# EAGLE design SolarSprinkler (EAGLE 7.5.0)
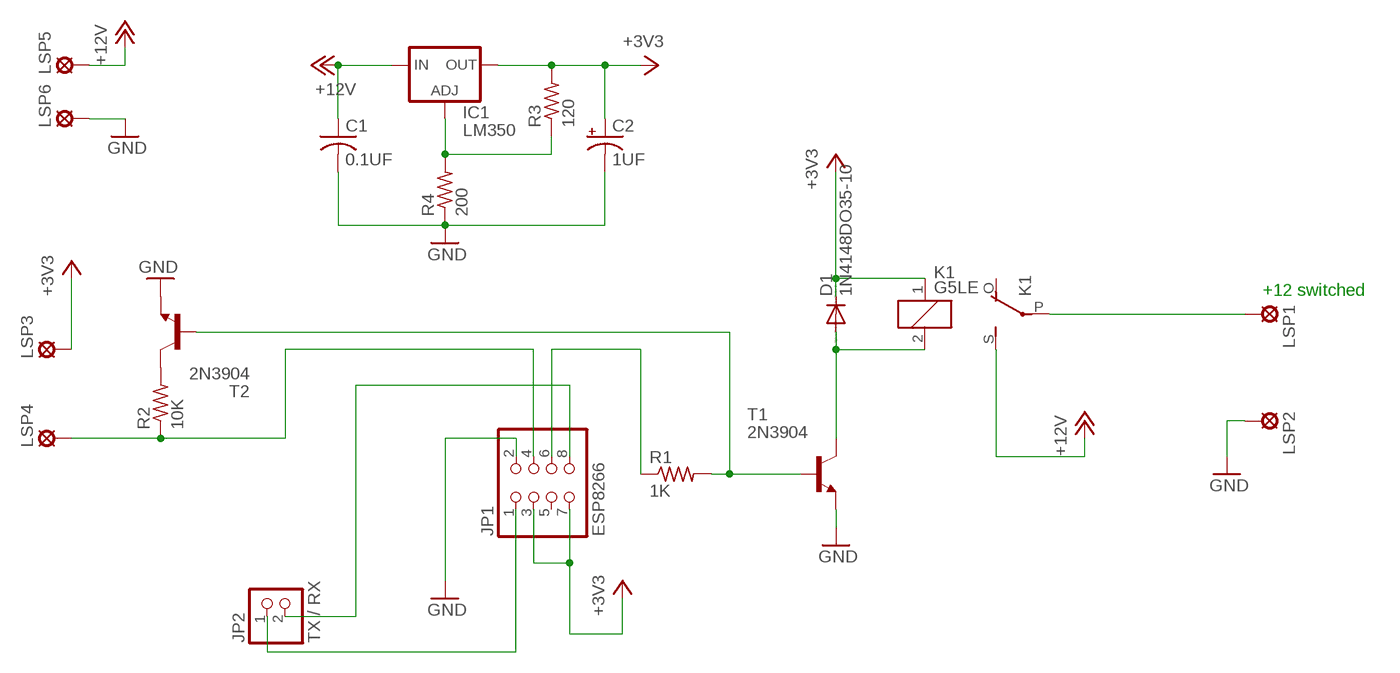
[diagram p0: schematic, sheet 1]

## Parts
C1  0.1UF  C-US025-030X050  [C025-030X050]
C2  1UF  CPOL-USE2.5-5  [E2,5-5]
D1  1N4148DO35-10  [DO35-10]
IC1  LM350  LM317TL  [317TL]
JP1  ESP8266  PINHD-2X4  [2X04]
JP2  TX / RX  PINHD-1X2  [1X02]
K1  G5LE  [G5LE]
LSP1  SE14  [SE14]
LSP2  SE14  [SE14]
LSP3  SE14  [SE14]
LSP4  SE14  [SE14]
LSP5  SE14  [SE14]
LSP6  SE14  [SE14]
R1  1K  R-US_0309/12  [0309/12]
R2  10K  R-US_0309/12  [0309/12]
R3  120  R-US_0309/12  [0309/12]
R4  200  R-US_0309/12  [0309/12]
T1  2N3904  [TO92]
T2  2N3904  [TO92]

## Nets
+3V3 [3v]: C2.+ D1.C IC1.2(OUT) JP1.3 JP1.7 K1.1 LSP3.MP R3.2
+12V [12v]: C1.1 IC1.3(IN) K1.S(2:S) LSP5.MP
GND [Ground]: C1.2 C2.- JP1.2 LSP2.MP LSP6.MP R4.1 T1.3(E) T2.3(E)
N$1: JP1.6 R1.1
N$2: R1.2 T1.2(B) T2.2(B)
N$3: D1.A K1.2 T1.1(C)
N$4: R2.2 T2.1(C)
N$5 [12v switched]: K1.P(2:P) LSP1.MP
N$6: JP1.4 LSP4.MP R2.1
N$8: IC1.1(ADJ) R3.1 R4.2
N$10: JP1.8 JP2.2
N$11: JP1.1 JP2.1
Unconnected: JP1.5 K1.O(2:O)

## Notes on the sheet
- +12 switched

## Library data of the parts
C1 = rcl:C-US: CAPACITOR, American symbol
C2 = rcl:CPOL-US: POLARIZED CAPACITOR, American symbol
D1 = diode:1N4148: DIODE high speed (Philips)
IC1 = v-reg:LM317TL: VOLTAGE REGULATOR
JP1 = pinhead:PINHD-2X4: PIN HEADER
JP2 = pinhead:PINHD-1X2: PIN HEADER
K1 = relay:G5LE: RELAY 1 x switch, 10 A/120 V AC, 8 A/30 V DC, Omron; OC_FARNELL: unknown; OC_NEWARK: unknown
LSP1-LSP6 = solpad:SE14: SOLDER PAD E1553, drill 1,4mm, distributor Buerklin, 07F820
R1-R4 = resistor:R-US_: RESISTOR, American symbol
T1 T2 = transistor:2N3904: NPN TRANSISTOR

## Net classes
0 default: width 0.61 mm
1 Ground: width 0.914 mm
2 12v: width 0.914 mm
3 3v: width 0.61 mm
4 12v switched: width 0.914 mm

## Board
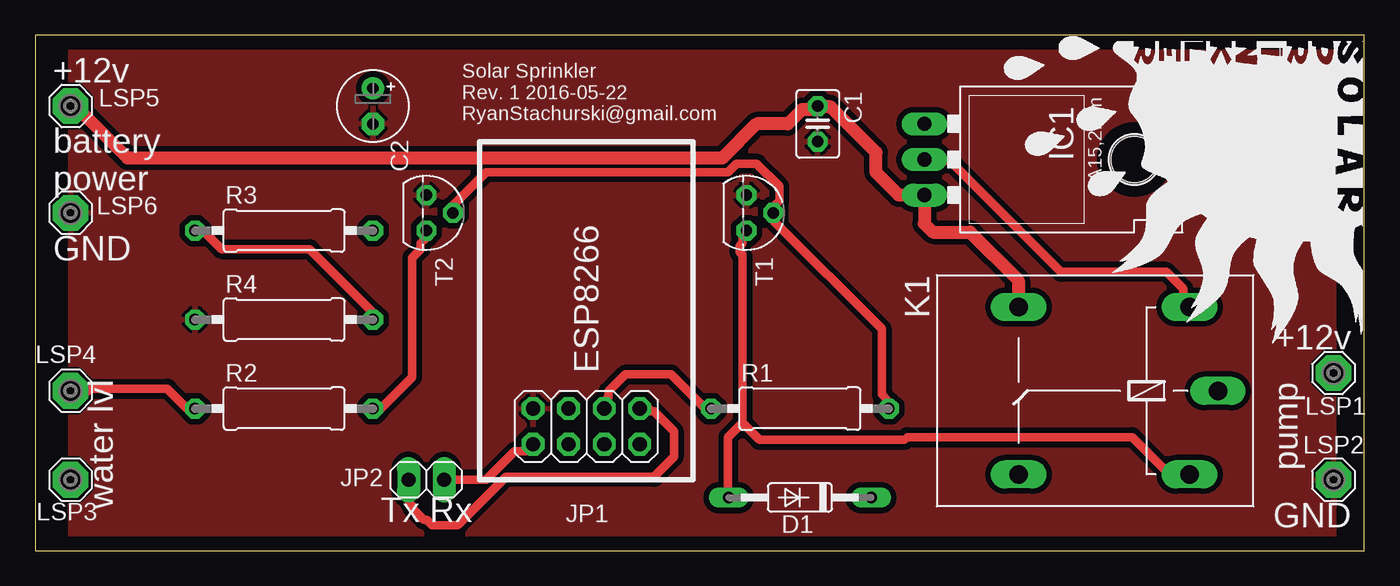
[diagram p1: board, top side]
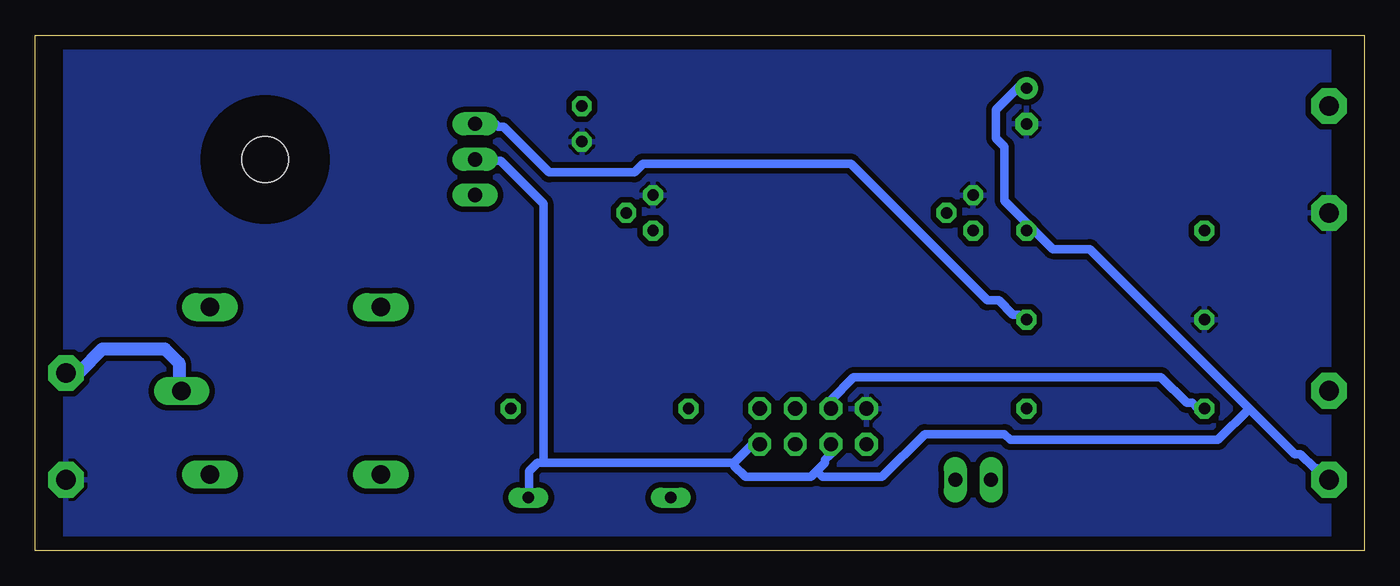
[diagram p2: board, bottom side, seen from below]

Size 94.92 x 36.82 mm. Coordinates in mm from the lower left corner, seen from the top.
Outline: 0,0 94.92,0 94.92,36.82 0,36.82 0,0
Copper layers (1*16): Top 0.035mm / dielectric 1.5mm / Bottom 0.035mm
Design rules "default *": minimum track width 10mil, minimum drill 24mil, track to track 8mil, track to pad 8mil, pad to pad 8mil, via to via 8mil, smd to smd 8mil, copper to edge 40mil, drill to drill 8mil, minimum pad ring 12mil, minimum via ring 8mil, stop-mask expansion 4mil, vias tented up to drill 0mil, thermal gap 10mil

### Footprints (pad centres in the part's own frame; a part is rotated, then mirrored left to right if it is on the bottom)
C025-030X050 = drill 0.813 octagon: 1 -1.27,0; 2 1.27,0
E2,5-5 = drill 0.813 pad 1.6: + -1.27,0 | drill 0.813 pad 1.6 octagon: - 1.27,0
DO35-10 = drill 0.813 long: A 5.08,0; C -5.08,0
317TL = drill 1.016 long: 1 -2.54,-3.81; 2 0,-3.81; 3 2.54,-3.81 | hole 3.302: 0,11.176
2X04 = drill 1.016 octagon: 1 -3.81,-1.27; 2 -3.81,1.27; 3 -1.27,-1.27; 4 -1.27,1.27; 5 1.27,-1.27; 6 1.27,1.27; 7 3.81,-1.27; 8 3.81,1.27
1X02 = drill 1.016 long: 1 -1.27,0; 2 1.27,0
G5LE = drill 1.321 long: 1 -7.493,-5.969; 2 -7.493,5.969; O 4.699,5.969; P -9.525,0; S 4.699,-5.969
SE14 = drill 1.397 pad 2.54 octagon: MP 0,0
0309/12 = drill 0.813 octagon: 1 -6.35,0; 2 6.35,0
TO92 = drill 0.813 octagon: 1 1.27,0; 2 0,1.905; 3 -1.27,0

### Placement (x,y rotation side)
C1  55.88,30.48 270 top
C2  24.13,31.75 270 top
D1  54.61,3.81 180 top
IC1  67.31,27.94 270 top
JP1  39.37,8.89 0 top
JP2  27.94,5.08 180 top
K1  74.93,11.43 180 top
LSP1  92.71,12.7 0 top
LSP2  92.71,5.08 0 top
LSP3  2.54,5.08 0 top
LSP4  2.54,11.43 0 top
LSP5  2.54,31.75 0 top
LSP6  2.54,24.13 0 top
R1  54.61,10.16 0 top
R2  17.78,10.16 0 top
R3  17.78,22.86 0 top
R4  17.78,16.51 0 top
T1  50.8,24.13 270 top
T2  27.94,24.13 270 top

### Tracks (layer width: path | path; a pad name or v marks a point on that pad's centre or on a via)
+3V3
  Top 0.61: IC1.2 63.5,27.84 65.33,27.84 73.25,19.91 80.77,19.91 81.99,18.69 81.99,17.88 82.4,17.48 K1.1
  Bottom 0.61: C2.+ 24.28,33.12 24.69,33.12 26.31,31.5 26.31,29.46 25.71,28.85 25.71,24.99 24.08,23.37 24.08,22.96 R3.2 23.88,23.16 22.25,21.54 19.61,21.54 8.23,10.16 | LSP3.MP 3.35,5.89 3.56,5.89 4.57,6.91 4.98,6.91 8.23,10.16 | 45.01,6.3 58.62,6.3 | 58.62,6.3 59.03,6.3 59.64,5.69 59.64,3.86 D1.C | 45.01,6.3 43.79,7.52 43.18,7.52 JP1.7 | JP1.3 38.1,6.91 38.51,6.5 38.51,6.3 39.12,5.69 | 39.12,5.69 39.52,5.28 44.2,5.28 45.01,6.1 45.01,6.3 | 58.62,6.3 58.62,24.79 61.67,27.84 63.5,27.84 IC1.2 | 8.23,10.16 10.46,7.92 25.3,7.92 25.71,8.33 31.39,8.33 34.44,5.28 38.71,5.28 39.12,5.69
+12V
  Top 0.914: K1.S 70.21,17.48 70.21,19.3 66.75,22.76 64.11,22.76 63.5,23.37 IC1.3 61.67,25.4 60.05,27.03 60.05,28.45 56.79,31.7 55.98,31.7 C1.1 55.58,31.5 54.76,31.5 53.75,30.48 51.51,30.48 49.07,28.04 6.6,28.04 2.95,31.7 2.54,31.7 LSP5.MP
GND
  pour Top (isolate 0.406): 2.54,0 2.54,36.83 92.71,36.83 92.71,0
  pour Bottom (isolate 0.406): 2.54,0 2.54,36.83 92.71,36.83 92.71,0
N$1
  Top 0.61: R1.1 47.85,10.16 45.41,12.6 42.16,12.6 40.95,11.38 40.95,10.97 40.74,10.77 40.74,10.16 JP1.6
N$2
  Top 0.61: R1.2 60.86,10.16 60.86,10.77 60.45,11.18 60.45,15.85 52.73,23.57 52.73,23.98 T1.2 52.93,24.18 52.93,24.38 52.73,24.59 53.14,24.99 53.14,26.01 51.51,27.64 50.09,27.64 49.48,27.03 32.21,27.03 29.77,24.59 29.77,24.18 T2.2
N$3
  Top 0.61: 50.49,9.14 49.48,8.13 49.48,3.86 D1.A | 50.49,9.14 50.49,21.13 50.29,21.34 50.29,21.74 50.49,21.95 50.49,22.35 50.9,22.76 T1.1 | 50.49,9.14 51.71,7.92 62.08,7.92 62.28,8.13 78.33,8.13 80.97,5.49 82.4,5.49 K1.2
N$4
  Top 0.61: R2.2 24.69,10.16 26.92,12.39 26.92,20.93 27.53,21.54 27.53,21.95 27.94,22.35 T2.1
N$5
  Bottom 0.914: K1.P 84.63,11.58 84.63,13.41 85.65,14.43 90.12,14.43 91.74,12.8 92.56,12.8 LSP1.MP
N$6
  Top 0.61: R2.1 10.87,10.16 9.45,11.58 3.96,11.58 3.56,11.18 2.74,11.18 2.54,11.38 LSP4.MP
  Bottom 0.61: JP1.4 38.1,10.77 36.47,12.39 14.53,12.39 12.7,10.57 12.29,10.57 11.89,10.16 R2.1
N$8
  Top 0.61: R4.2 24.08,16.66 24.08,17.07 19.61,21.54 13.31,21.54 11.89,22.96 11.48,22.96 R3.1
  Bottom 0.61: IC1.1 62.08,30.48 61.87,30.28 61.47,30.28 58.22,27.03 52.12,27.03 51.51,27.64 36.68,27.64 26.92,17.88 26.11,17.88 25.1,16.87 24.69,16.87 24.28,16.46 R4.2
N$10
  Top 0.61: JP1.8 43.79,10.16 43.99,9.96 44.2,9.96 45.62,8.53 45.62,6.71 44.2,5.28 33.63,5.28 30.18,1.83 28.35,1.83 27.94,2.23 27.74,2.23 26.92,3.05 26.92,3.25 26.72,3.45 26.72,5.08 JP2.2
N$11
  Top 0.61: JP2.1 32.21,5.08 34.24,7.11 35.05,7.11 JP1.1

### Text on the board
tPlace: +12v | Solar Sprinkler / Rev. 1 2016-05-22 / RyanStachurski@gmail.com | battery / power | GND | +12v | ESP8266 | pump | water lvl | Tx Rx | GND
201bmp: /home/ryan/Downloads/solarsprinklerlogo.bmp